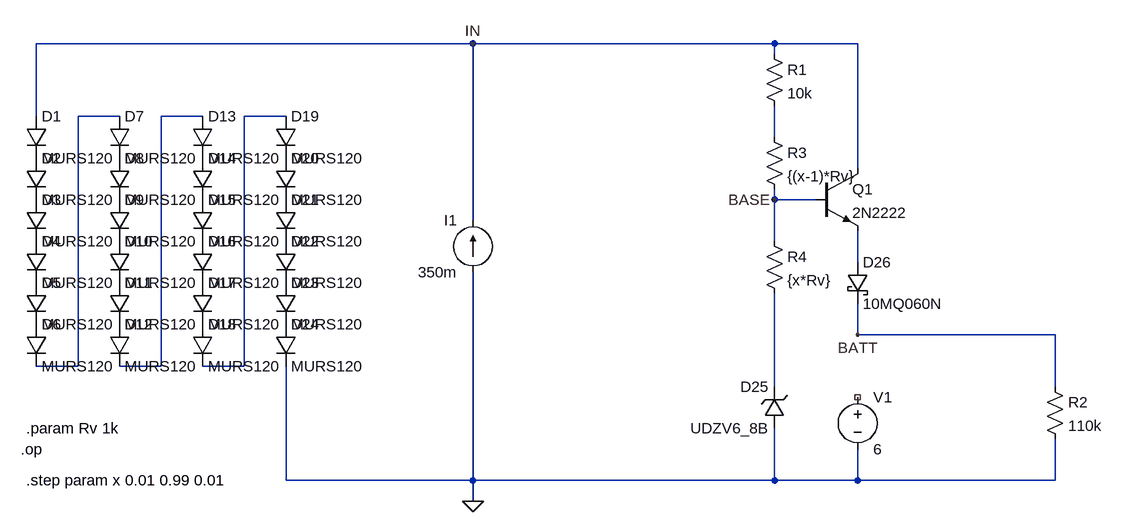
[diagram p0: schematic Laderegler.asc]
Laderegler.asc, the LTspice schematic file:
Version 4
SHEET 1 1736 708
WIRE 752 -16 80 -16
WIRE 1216 -16 752 -16
WIRE 1344 -16 1216 -16
WIRE 1216 0 1216 -16
WIRE 80 96 80 -16
WIRE 208 96 144 96
WIRE 336 96 272 96
WIRE 464 96 400 96
WIRE 1216 128 1216 80
WIRE 1344 176 1344 -16
WIRE 1216 224 1216 208
WIRE 1280 224 1216 224
WIRE 752 256 752 -16
WIRE 1216 288 1216 224
WIRE 1344 320 1344 272
WIRE 1344 432 1344 384
WIRE 1648 432 1344 432
WIRE 144 480 144 96
WIRE 144 480 80 480
WIRE 272 480 272 96
WIRE 272 480 208 480
WIRE 400 480 400 96
WIRE 400 480 336 480
WIRE 1216 512 1216 368
WIRE 1648 512 1648 432
WIRE 464 656 464 480
WIRE 752 656 752 336
WIRE 752 656 464 656
WIRE 1216 656 1216 576
WIRE 1216 656 752 656
WIRE 1344 656 1344 608
WIRE 1344 656 1216 656
WIRE 1648 656 1648 592
WIRE 1648 656 1344 656
WIRE 752 688 752 656
FLAG 752 688 0
FLAG 752 -16 IN
FLAG 1344 432 BATT
FLAG 1216 224 BASE
SYMBOL diode 64 96 R0
SYMATTR InstName D1
SYMATTR Value MURS120
SYMBOL diode 64 160 R0
SYMATTR InstName D2
SYMATTR Value MURS120
SYMBOL diode 64 224 R0
SYMATTR InstName D3
SYMATTR Value MURS120
SYMBOL diode 64 288 R0
SYMATTR InstName D4
SYMATTR Value MURS120
SYMBOL diode 64 352 R0
SYMATTR InstName D5
SYMATTR Value MURS120
SYMBOL diode 64 416 R0
SYMATTR InstName D6
SYMATTR Value MURS120
SYMBOL diode 192 96 R0
SYMATTR InstName D7
SYMATTR Value MURS120
SYMBOL diode 192 160 R0
SYMATTR InstName D8
SYMATTR Value MURS120
SYMBOL diode 192 224 R0
SYMATTR InstName D9
SYMATTR Value MURS120
SYMBOL diode 192 288 R0
SYMATTR InstName D10
SYMATTR Value MURS120
SYMBOL diode 192 352 R0
SYMATTR InstName D11
SYMATTR Value MURS120
SYMBOL diode 192 416 R0
SYMATTR InstName D12
SYMATTR Value MURS120
SYMBOL diode 320 96 R0
SYMATTR InstName D13
SYMATTR Value MURS120
SYMBOL diode 320 160 R0
SYMATTR InstName D14
SYMATTR Value MURS120
SYMBOL diode 320 224 R0
SYMATTR InstName D15
SYMATTR Value MURS120
SYMBOL diode 320 288 R0
SYMATTR InstName D16
SYMATTR Value MURS120
SYMBOL diode 320 352 R0
SYMATTR InstName D17
SYMATTR Value MURS120
SYMBOL diode 320 416 R0
SYMATTR InstName D18
SYMATTR Value MURS120
SYMBOL diode 448 96 R0
SYMATTR InstName D19
SYMATTR Value MURS120
SYMBOL diode 448 160 R0
SYMATTR InstName D20
SYMATTR Value MURS120
SYMBOL diode 448 224 R0
SYMATTR InstName D21
SYMATTR Value MURS120
SYMBOL diode 448 288 R0
SYMATTR InstName D22
SYMATTR Value MURS120
SYMBOL diode 448 352 R0
SYMATTR InstName D23
SYMATTR Value MURS120
SYMBOL diode 448 416 R0
SYMATTR InstName D24
SYMATTR Value MURS120
SYMBOL current 752 336 R180
WINDOW 0 24 80 Left 2
WINDOW 3 24 0 Left 2
WINDOW 123 0 0 Left 0
WINDOW 39 0 0 Left 0
SYMATTR InstName I1
SYMATTR Value 350m
SYMBOL voltage 1344 512 R0
WINDOW 123 0 0 Left 0
WINDOW 39 0 0 Left 0
SYMATTR InstName V1
SYMATTR Value 6
SYMBOL npn 1280 176 R0
SYMATTR InstName Q1
SYMATTR Value 2N2222
SYMBOL zener 1232 576 R180
WINDOW 0 24 64 Left 2
WINDOW 3 24 0 Left 2
SYMATTR InstName D25
SYMATTR Value UDZV6_8B
SYMATTR Description Diode
SYMATTR Type diode
SYMBOL res 1200 -16 R0
SYMATTR InstName R1
SYMATTR Value 10k
SYMBOL res 1632 496 R0
SYMATTR InstName R2
SYMATTR Value 110k
SYMBOL res 1200 112 R0
SYMATTR InstName R3
SYMATTR Value {(x-1)*Rv}
SYMBOL res 1200 272 R0
SYMATTR InstName R4
SYMATTR Value {x*Rv}
SYMBOL schottky 1328 320 R0
SYMATTR InstName D26
SYMATTR Value 10MQ060N
SYMATTR Description Diode
SYMATTR Type diode
TEXT 56 608 Left 2 !.op
TEXT 64 576 Left 2 !.param Rv 1k
TEXT 64 656 Left 2 !.step param x 0.01 0.99 0.01

The netlist it stands for:
* Laderegler.asc
D1 IN P001 MURS120
D2 P001 P002 MURS120
D3 P002 P003 MURS120
D4 P003 P004 MURS120
D5 P004 P005 MURS120
D6 P005 N001 MURS120
D7 N001 P006 MURS120
D8 P006 P007 MURS120
D9 P007 P008 MURS120
D10 P008 P009 MURS120
D11 P009 P010 MURS120
D12 P010 N002 MURS120
D13 N002 P011 MURS120
D14 P011 P012 MURS120
D15 P012 P013 MURS120
D16 P013 P014 MURS120
D17 P014 P015 MURS120
D18 P015 N003 MURS120
D19 N003 P016 MURS120
D20 P016 P017 MURS120
D21 P017 P018 MURS120
D22 P018 P019 MURS120
D23 P019 P020 MURS120
D24 P020 0 MURS120
I1 0 IN 350m
V1 NC_01 0 6
Q1 IN BASE N005 0 2N2222
D25 0 N006 UDZV6_8B
R1 IN N004 10k
R2 BATT 0 110k
R3 N004 BASE {(x-1)*Rv}
R4 BASE N006 {x*Rv}
D26 N005 BATT 10MQ060N
.model D D
.lib standard.dio
.model NPN NPN
.model PNP PNP
.lib standard.bjt
.op
.param Rv 1k
.step param x 0.01 0.99 0.01
.backanno
.end

* Results of the author's LTspice run, read from the files saved beside the schematic
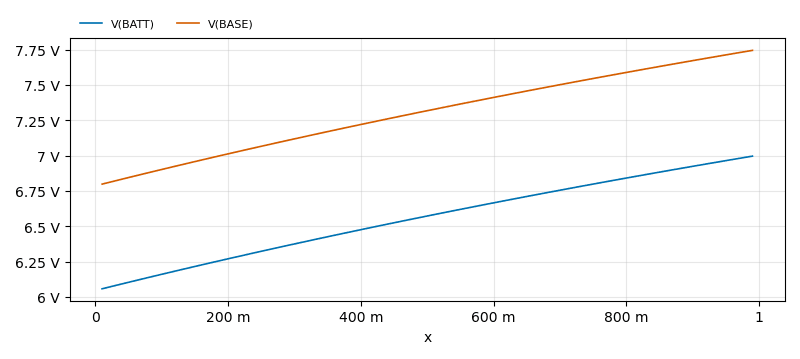
[diagram p1: Operating Point of Laderegler.asc, plotted from the saved traces]
* Operating Point, 1 run:
*   V(BATT): 6.058 V at x=10 m, 6.996 V at x=990 m, min 6.058 V, max 6.996 V
*   V(BASE): 6.798 V at x=10 m, 7.745 V at x=990 m, min 6.798 V, max 7.745 V
* From the log:
*   Semiconductor Device Operating Points:
*                           --- Diodes ---
*   Name:      d26         d25         d24         d23         d22
*   Model:  10mq060n    udzv6_8b     murs120     murs120     murs120
*   Id:      5.51e-05   -1.18e-03    3.49e-01    3.49e-01    3.49e-01
*   Vd:      1.63e-01   -6.79e+00    7.26e-01    7.26e-01    7.26e-01
*   Req:     4.69e+02    2.17e+00    1.27e-01    1.27e-01    1.27e-01
*   CAP:     1.08e-10    3.92e-08    3.53e-07    3.53e-07    3.53e-07
*   Name:      d21         d20         d19         d18         d17
*   Model:   murs120     murs120     murs120     murs120     murs120
*   Id:      3.49e-01    3.49e-01    3.49e-01    3.49e-01    3.49e-01
*   Vd:      7.26e-01    7.26e-01    7.26e-01    7.26e-01    7.26e-01
*   Req:     1.27e-01    1.27e-01    1.27e-01    1.27e-01    1.27e-01
*   CAP:     3.53e-07    3.53e-07    3.53e-07    3.53e-07    3.53e-07
*   Name:      d16         d15         d14         d13         d12
*   Model:   murs120     murs120     murs120     murs120     murs120
*   Id:      3.49e-01    3.49e-01    3.49e-01    3.49e-01    3.49e-01
*   Vd:      7.26e-01    7.26e-01    7.26e-01    7.26e-01    7.26e-01
*   Req:     1.27e-01    1.27e-01    1.27e-01    1.27e-01    1.27e-01
*   CAP:     3.53e-07    3.53e-07    3.53e-07    3.53e-07    3.53e-07
*   Name:      d11         d10         d9          d8          d7
*   Model:   murs120     murs120     murs120     murs120     murs120
*   Id:      3.49e-01    3.49e-01    3.49e-01    3.49e-01    3.49e-01
*   Vd:      7.26e-01    7.26e-01    7.26e-01    7.26e-01    7.26e-01
*   Req:     1.27e-01    1.27e-01    1.27e-01    1.27e-01    1.27e-01
*   CAP:     3.53e-07    3.53e-07    3.53e-07    3.53e-07    3.53e-07
*   Name:      d6          d5          d4          d3          d2
*   Model:   murs120     murs120     murs120     murs120     murs120
*   Id:      3.49e-01    3.49e-01    3.49e-01    3.49e-01    3.49e-01
*   Vd:      7.26e-01    7.26e-01    7.26e-01    7.26e-01    7.26e-01
*   Req:     1.27e-01    1.27e-01    1.27e-01    1.27e-01    1.27e-01
*   CAP:     3.53e-07    3.53e-07    3.53e-07    3.53e-07    3.53e-07
*   Name:      d1
*   Model:   murs120
*   Id:      3.49e-01
*   Vd:      7.26e-01
*   Req:     1.27e-01
*   CAP:     3.53e-07
*                           --- Bipolar Transistors ---
*   Name:       q1
*   Model:    2n2222
*   Ib:       2.48e-07
*   Ic:       5.48e-05
*   Vbe:      5.77e-01
*   Vbc:     -1.06e+01
*   Vce:      1.12e+01
*   BetaDC:   2.21e+02
*   Gm:       2.12e-03
*   Rpi:      1.04e+05
*   Rx:       1.00e+01
*   Ro:       2.02e+06
*   Cbe:      3.79e-11
*   Cbc:      3.26e-12
*   Cjs:      0.00e+00
*   BetaAC:   2.21e+02
*   Cbx:      0.00e+00
*   Ft:       8.20e+06